# Altium schematic sheet TopSheet.SchDoc
size A4; CompanyName: Zohm Control; Organization: UltraZohm; Address1: Kesslerplatz 12; Address2: 90489 Nürnberg; Address3: GERMANY; Revision: 1; SheetNumber: 1; SheetTotal: 6; Website: www.ultrazohm.com
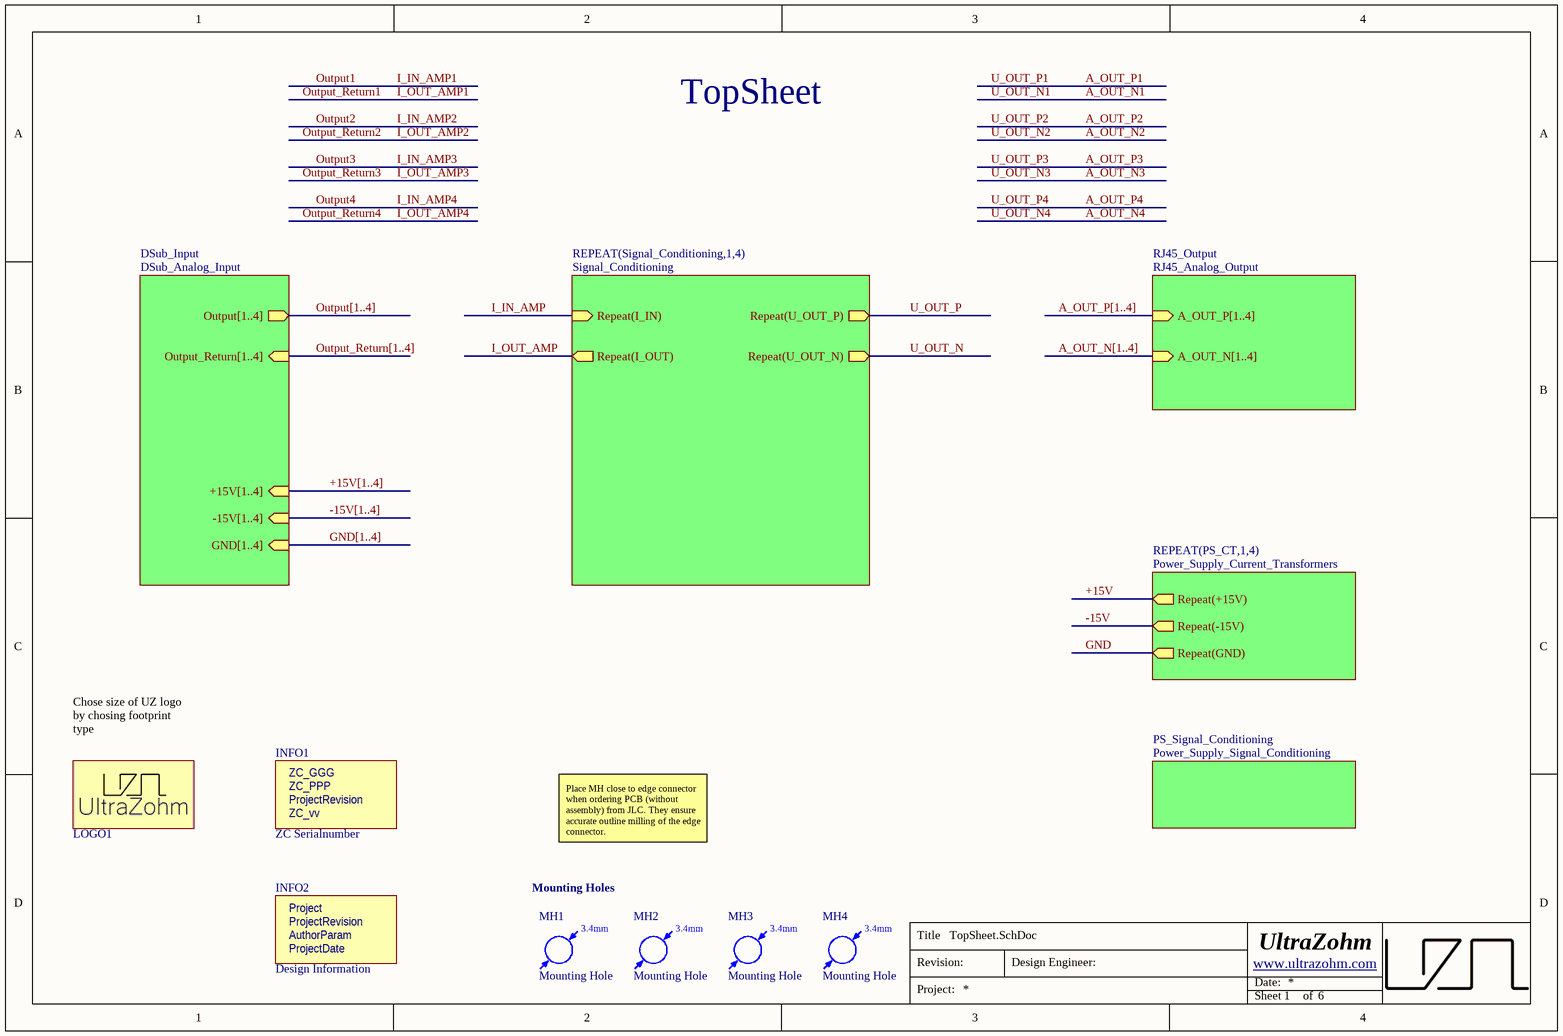
[diagram p0: TopSheet.SchDoc]

## Parts
INFO1  ZC Serialnumber  [ZC-Serial]  (no BOM)
INFO2  Design Information  [Design_info]  (no BOM)
LOGO1  UZ Logo  [UZ_Logo_small]  (value not drawn)  (no BOM)
MH1  Mounting Hole  [MH_3.4]  (no BOM)
MH2  Mounting Hole  [MH_3.4]  (no BOM)
MH3  Mounting Hole  [MH_3.4]  (no BOM)
MH4  Mounting Hole  [MH_3.4]  (no BOM)

## Sub-sheets
DSub_Input = DSub_Analog_Input: Output[1..4] (out), Output_Return[1..4] (in), +15V[1..4] (in), -15V[1..4] (in), GND[1..4] (in)
PS_Signal_Conditioning = Power_Supply_Signal_Conditioning: no entries
REPEAT(PS_CT,1,4) = Power_Supply_Current_Transformers: Repeat(+15V) (out), Repeat(-15V) (out), Repeat(GND) (out)
REPEAT(Signal_Conditioning,1,4) = Signal_Conditioning: Repeat(I_IN) (in), Repeat(I_OUT) (out), Repeat(U_OUT_P) (out), Repeat(U_OUT_N) (out)
RJ45_Output = RJ45_Analog_Output: A_OUT_P[1..4] (in), A_OUT_N[1..4] (in)

## Nets
+15V: sheet REPEAT(PS_CT,1,4)/Repeat(+15V)
-15V: sheet REPEAT(PS_CT,1,4)/Repeat(-15V)
GND: sheet REPEAT(PS_CT,1,4)/Repeat(GND)
I_IN_AMP: sheet REPEAT(Signal_Conditioning,1,4)/Repeat(I_IN)
I_OUT_AMP: sheet REPEAT(Signal_Conditioning,1,4)/Repeat(I_OUT)
U_OUT_N: sheet REPEAT(Signal_Conditioning,1,4)/Repeat(U_OUT_N)
U_OUT_P: sheet REPEAT(Signal_Conditioning,1,4)/Repeat(U_OUT_P)

## Buses and harness runs
bus +15V[1..4] = sheet DSub_Input/+15V[1..4]
bus -15V[1..4] = sheet DSub_Input/-15V[1..4]
bus A_OUT_N[1..4] = sheet RJ45_Output/A_OUT_N[1..4]
bus A_OUT_P[1..4] = sheet RJ45_Output/A_OUT_P[1..4]
bus GND[1..4] = sheet DSub_Input/GND[1..4]
bus Output[1..4] = sheet DSub_Input/Output[1..4]
bus Output_Return[1..4] = sheet DSub_Input/Output_Return[1..4]

## Notes on the sheet
- TopSheet
- (near LOGO1) Chose size of UZ logo by chosing footprint type
- Place MH close to edge connector when ordering PCB (without assembly) from JLC. They ensure accurate outline milling of the edge connector.
- Mounting Holes
- Title
- Revision:
- Design Engineer:
- Date:
- Project:
- Sheet
- of
- (in symbol Design Information) Project; ProjectRevision; AuthorParam; ProjectDate
- (in symbol Mounting Hole) 3.4mm
- (in symbol ZC-Serial) ZC_GGG; ZC_PPP; ProjectRevision; ZC_vv

## Library data of the parts
INFO1 = ZC-Serial: Manufacturer: UltraZohm; Value: GGG-PPP-VVvv; Created from: FRosner; Manufacturer Part Number: ZC-Serial; PartID: 58; Created On: 15/04/2025 09:17:14; ComponentLink1Description: https://docs.ultrazohm.com/; ComponentLink1URL: homepage; Component Type: ZC Serialnumber; Last Updated: 15/04/2025 09:17:14; Supplier 1: -; Supplier Part Number 1: -; Type: Serial Number; Live Cycle Status: 1
INFO2 = Design Information: Manufacturer: UltraZohm; Created from: MGremer; Manufacturer Part Number: Design Information; PartID: 12; Created On: 03/11/2021 09:04:23; ComponentLink1Description: https://docs.ultrazohm.com/; ComponentLink1URL: homepage; Component Type: Design Information; Last Updated: 15/04/2025 09:29:36; Supplier 1: -; Supplier Part Number 1: -; Type: Design Information; Value: Design Information; Live Cycle Status: 1
LOGO1 = 1: Official Project Logo of the UltraZohm; Manufacturer: PCB Manufacturer; Manufacturer Part Number: UltraZohm Logo; Created from: T. Wendt; PartID: 1; Created On: 19.02.2021 16:55:56; ComponentLink1Description: Homepage; ComponentLink1URL: https://ultrazohm.com; Component Type: Logo; Last Updated: 02.03.2021 14:31:24; Type: Standard (No BOM); Live Cycle Status: 1
MH1-MH4 = Mounting Hole: Created from: MHlatky; Manufacturer Part Number: Mounting Hole; PartID: 16; Created On: 26/01/2021 09:19:51; ComponentLink1Description: Datasheet; Component Type: Mounting Hole; Device Package: -; Last Updated: 21/03/2022 23:05:12; Manufacturer: Mounting Hole; Supplier 1: Mounting Hole; Supplier Part Number 1: Mounting Hole; Type: Mounting Hole; Value: Mounting Hole; Live Cycle Status: 1; Stock number: not stored